# Altium schematic sheet top.SchDoc
size A4; SheetNumber: 1; SheetTotal: 6
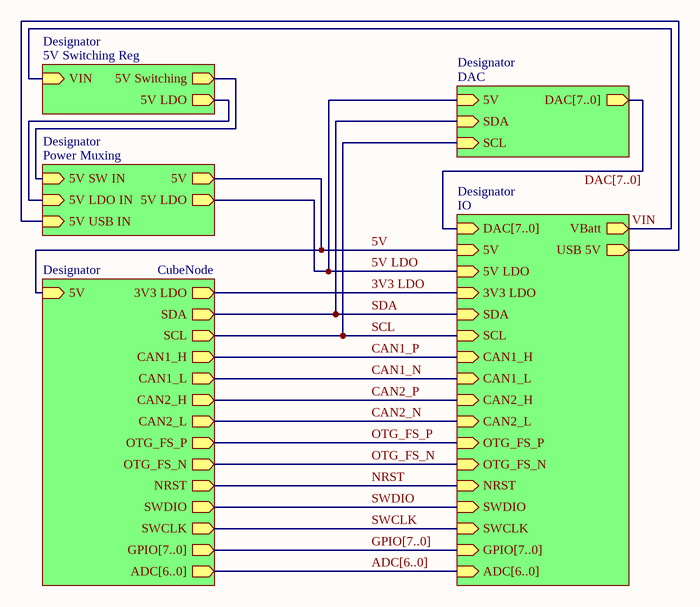
[diagram p0: top.SchDoc]

## Sub-sheets
Designator = 5V Switching Reg: 5V Switching (out), VIN (in), 5V LDO (out)
Designator = DAC: SCL (in), SDA (in), 5V (in), DAC[7..0] (out)
Designator = IO: DAC[7..0] (in), 5V LDO (in), VBatt (out), 5V (in), USB 5V (out), SDA (in), SCL (in), GPIO[7..0] (in), CAN1_H (in), CAN1_L (in), OTG_FS_P (in), OTG_FS_N (in), ADC[6..0] (in), CAN2_H (in), CAN2_L (in), SWDIO (in), SWCLK (in), NRST (in), 3V3 LDO (in)
Designator = CubeNode: 5V (in), 3V3 LDO (out), GPIO[7..0] (out), ADC[6..0] (out), SWDIO (out), SWCLK (out), SDA (out), SCL (out), CAN1_H (out), CAN1_L (out), OTG_FS_P (out), OTG_FS_N (out), CAN2_H (out), CAN2_L (out), NRST (out)
Designator = Power Muxing: 5V USB IN (in), 5V SW IN (in), 5V (out), 5V LDO (out), 5V LDO IN (in)

## Nets
3V3 LDO: sheet Designator/3V3 LDO, sheet Designator/3V3 LDO
5V: sheet Designator/5V, sheet Designator/5V, sheet Designator/5V
5V LDO: sheet Designator/5V, sheet Designator/5V LDO, sheet Designator/5V LDO
CAN1_N: sheet Designator/CAN1_L, sheet Designator/CAN1_L
CAN1_P: sheet Designator/CAN1_H, sheet Designator/CAN1_H
CAN2_N: sheet Designator/CAN2_L, sheet Designator/CAN2_L
CAN2_P: sheet Designator/CAN2_H, sheet Designator/CAN2_H
NRST: sheet Designator/NRST, sheet Designator/NRST
OTG_FS_N: sheet Designator/OTG_FS_N, sheet Designator/OTG_FS_N
OTG_FS_P: sheet Designator/OTG_FS_P, sheet Designator/OTG_FS_P
SCL: sheet Designator/SCL, sheet Designator/SCL, sheet Designator/SCL
SDA: sheet Designator/SDA, sheet Designator/SDA, sheet Designator/SDA
SWCLK: sheet Designator/SWCLK, sheet Designator/SWCLK
SWDIO: sheet Designator/SWDIO, sheet Designator/SWDIO
VIN: sheet Designator/VIN, sheet Designator/VBatt
(unnamed): sheet Designator/5V Switching, sheet Designator/5V SW IN
(unnamed): sheet Designator/5V LDO, sheet Designator/5V LDO IN
(unnamed): sheet Designator/USB 5V, sheet Designator/5V USB IN

## Buses and harness runs
bus ADC[6..0] = sheet Designator/ADC[6..0]
bus DAC[7..0] = sheet Designator/DAC[7..0]
bus GPIO[7..0] = sheet Designator/GPIO[7..0]